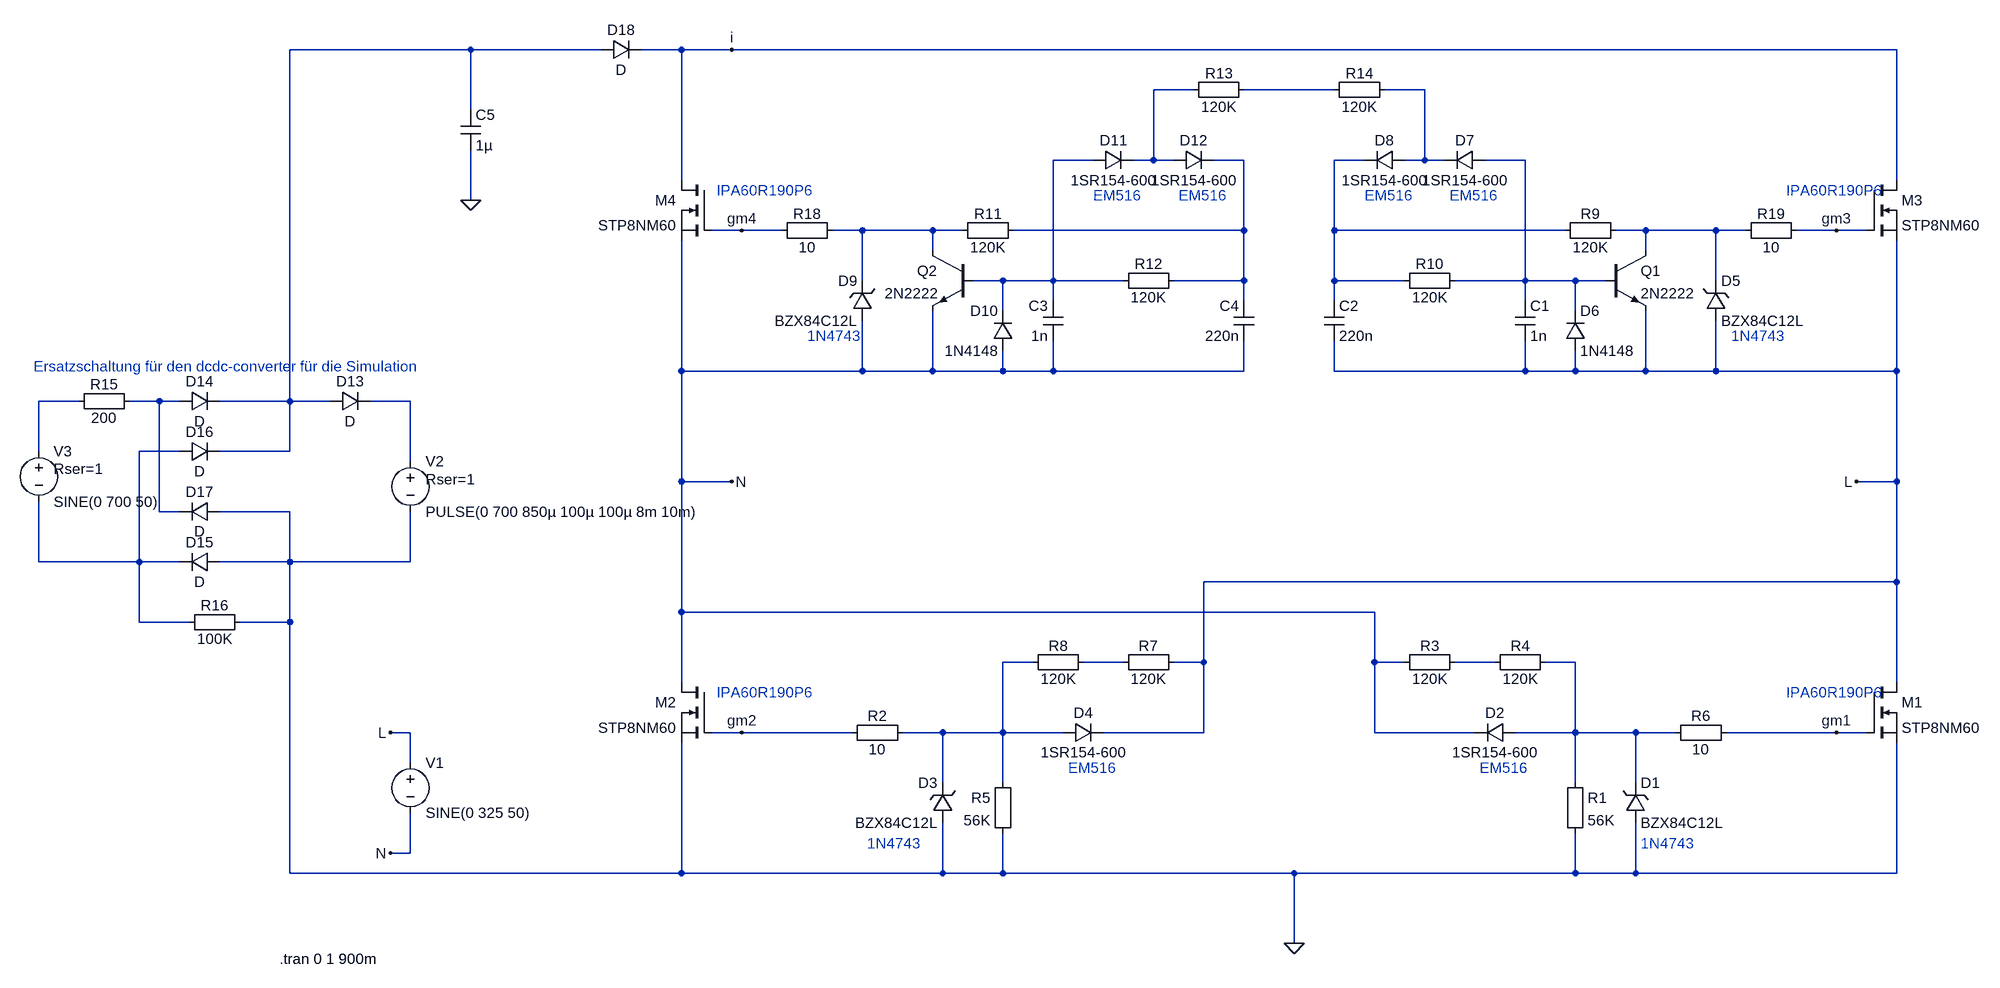
[diagram p0: schematic Einspeisebruecke-MK2-001.asc]
Einspeisebruecke-MK2-001.asc, the LTspice schematic file:
Version 4
SHEET 1 880 680
WIRE -1968 -880 -2256 -880
WIRE -1760 -880 -1968 -880
WIRE -1632 -880 -1696 -880
WIRE -1552 -880 -1632 -880
WIRE 304 -880 -1552 -880
WIRE -816 -816 -880 -816
WIRE -592 -816 -736 -816
WIRE -448 -816 -512 -816
WIRE -1968 -784 -1968 -880
WIRE -976 -704 -1040 -704
WIRE -880 -704 -880 -816
WIRE -880 -704 -912 -704
WIRE -848 -704 -880 -704
WIRE -736 -704 -784 -704
WIRE -544 -704 -592 -704
WIRE -448 -704 -448 -816
WIRE -448 -704 -480 -704
WIRE -416 -704 -448 -704
WIRE -288 -704 -352 -704
WIRE -1632 -672 -1632 -880
WIRE 304 -672 304 -880
WIRE -1968 -640 -1968 -720
WIRE -1536 -592 -1584 -592
WIRE -1472 -592 -1536 -592
WIRE -1344 -592 -1392 -592
WIRE -1232 -592 -1344 -592
WIRE -1184 -592 -1232 -592
WIRE -736 -592 -736 -704
WIRE -736 -592 -1104 -592
WIRE -592 -592 -592 -704
WIRE -224 -592 -592 -592
WIRE -96 -592 -144 -592
WIRE 16 -592 -96 -592
WIRE 64 -592 16 -592
WIRE 208 -592 144 -592
WIRE 256 -592 208 -592
WIRE -1232 -560 -1232 -592
WIRE -96 -560 -96 -592
WIRE -1344 -512 -1344 -592
WIRE -1120 -512 -1168 -512
WIRE -1040 -512 -1040 -704
WIRE -1040 -512 -1120 -512
WIRE -928 -512 -1040 -512
WIRE -736 -512 -736 -592
WIRE -736 -512 -848 -512
WIRE -592 -512 -592 -592
WIRE -480 -512 -592 -512
WIRE -288 -512 -288 -704
WIRE -288 -512 -400 -512
WIRE -208 -512 -288 -512
WIRE -160 -512 -208 -512
WIRE 16 -512 16 -592
WIRE -1040 -480 -1040 -512
WIRE -736 -480 -736 -512
WIRE -592 -480 -592 -512
WIRE -288 -480 -288 -512
WIRE -1120 -464 -1120 -512
WIRE -208 -464 -208 -512
WIRE -1632 -368 -1632 -576
WIRE -1344 -368 -1344 -448
WIRE -1344 -368 -1632 -368
WIRE -1232 -368 -1232 -464
WIRE -1232 -368 -1344 -368
WIRE -1120 -368 -1120 -400
WIRE -1120 -368 -1232 -368
WIRE -1040 -368 -1040 -416
WIRE -1040 -368 -1120 -368
WIRE -736 -368 -736 -416
WIRE -736 -368 -1040 -368
WIRE -592 -368 -592 -416
WIRE -288 -368 -288 -416
WIRE -288 -368 -592 -368
WIRE -208 -368 -208 -400
WIRE -208 -368 -288 -368
WIRE -96 -368 -96 -464
WIRE -96 -368 -208 -368
WIRE 16 -368 16 -448
WIRE 16 -368 -96 -368
WIRE 304 -368 304 -576
WIRE 304 -368 16 -368
WIRE -2592 -320 -2656 -320
WIRE -2464 -320 -2512 -320
WIRE -2432 -320 -2464 -320
WIRE -2256 -320 -2256 -880
WIRE -2256 -320 -2368 -320
WIRE -2192 -320 -2256 -320
WIRE -2064 -320 -2128 -320
WIRE -2656 -240 -2656 -320
WIRE -2432 -240 -2496 -240
WIRE -2256 -240 -2256 -320
WIRE -2256 -240 -2368 -240
WIRE -2064 -224 -2064 -320
WIRE -1632 -192 -1632 -368
WIRE -1552 -192 -1632 -192
WIRE 304 -192 304 -368
WIRE 304 -192 240 -192
WIRE -2464 -144 -2464 -320
WIRE -2432 -144 -2464 -144
WIRE -2256 -144 -2368 -144
WIRE -2656 -64 -2656 -160
WIRE -2496 -64 -2496 -240
WIRE -2496 -64 -2656 -64
WIRE -2432 -64 -2496 -64
WIRE -2256 -64 -2256 -144
WIRE -2256 -64 -2368 -64
WIRE -2064 -64 -2064 -144
WIRE -2064 -64 -2256 -64
WIRE 304 -32 304 -192
WIRE 304 -32 -800 -32
WIRE -1632 16 -1632 -192
WIRE -528 16 -1632 16
WIRE -2496 32 -2496 -64
WIRE -2416 32 -2496 32
WIRE -2256 32 -2256 -64
WIRE -2256 32 -2336 32
WIRE -1072 96 -1120 96
WIRE -928 96 -992 96
WIRE -800 96 -800 -32
WIRE -800 96 -848 96
WIRE -528 96 -528 16
WIRE -480 96 -528 96
WIRE -336 96 -400 96
WIRE -208 96 -256 96
WIRE -1632 128 -1632 16
WIRE 304 128 304 -32
WIRE -2064 208 -2096 208
WIRE -1536 208 -1584 208
WIRE -1360 208 -1536 208
WIRE -1216 208 -1280 208
WIRE -1120 208 -1120 96
WIRE -1120 208 -1216 208
WIRE -1024 208 -1120 208
WIRE -800 208 -800 96
WIRE -800 208 -960 208
WIRE -528 208 -528 96
WIRE -368 208 -528 208
WIRE -208 208 -208 96
WIRE -208 208 -304 208
WIRE -112 208 -208 208
WIRE -48 208 -112 208
WIRE 208 208 32 208
WIRE 256 208 208 208
WIRE -2064 256 -2064 208
WIRE -1216 288 -1216 208
WIRE -1120 288 -1120 208
WIRE -208 288 -208 208
WIRE -112 288 -112 208
WIRE -2064 400 -2064 336
WIRE -2064 400 -2096 400
WIRE -2256 432 -2256 32
WIRE -1632 432 -1632 224
WIRE -1632 432 -2256 432
WIRE -1216 432 -1216 352
WIRE -1216 432 -1632 432
WIRE -1120 432 -1120 368
WIRE -1120 432 -1216 432
WIRE -656 432 -1120 432
WIRE -208 432 -208 368
WIRE -208 432 -656 432
WIRE -112 432 -112 352
WIRE -112 432 -208 432
WIRE 304 432 304 224
WIRE 304 432 -112 432
WIRE -656 544 -656 432
FLAG -656 544 0
FLAG -2096 400 N
FLAG -2096 208 L
FLAG -1552 -192 N
FLAG 240 -192 L
FLAG -1536 -592 gm4
FLAG 208 -592 gm3
FLAG -1536 208 gm2
FLAG 208 208 gm1
FLAG -1552 -880 i
FLAG -1968 -640 0
SYMBOL nmos 256 128 R0
SYMATTR InstName M1
SYMATTR Value STP8NM60
SYMBOL zener -128 352 M180
WINDOW 0 24 64 Left 2
WINDOW 3 24 0 Left 2
SYMATTR InstName D1
SYMATTR Value BZX84C12L
SYMBOL Misc\\EuropeanResistor -224 272 R0
SYMATTR InstName R1
SYMATTR Value 56K
SYMBOL diode -304 192 R90
WINDOW 0 0 32 VBottom 2
WINDOW 3 32 32 VTop 2
SYMATTR InstName D2
SYMATTR Value 1SR154-600
SYMBOL Misc\\EuropeanResistor -384 80 R90
WINDOW 0 5 56 VBottom 2
WINDOW 3 27 56 VTop 2
SYMATTR InstName R3
SYMATTR Value 120K
SYMBOL Misc\\EuropeanResistor -240 80 R90
WINDOW 0 5 56 VBottom 2
WINDOW 3 27 56 VTop 2
SYMATTR InstName R4
SYMATTR Value 120K
SYMBOL nmos -1584 128 M0
SYMATTR InstName M2
SYMATTR Value STP8NM60
SYMBOL zener -1200 352 R180
WINDOW 0 24 64 Left 2
WINDOW 3 24 0 Left 2
SYMATTR InstName D3
SYMATTR Value BZX84C12L
SYMBOL Misc\\EuropeanResistor -1104 272 M0
SYMATTR InstName R5
SYMATTR Value 56K
SYMBOL diode -1024 192 M90
WINDOW 0 0 32 VBottom 2
WINDOW 3 32 32 VTop 2
SYMATTR InstName D4
SYMATTR Value 1SR154-600
SYMBOL Misc\\EuropeanResistor -944 80 M90
WINDOW 0 5 56 VBottom 2
WINDOW 3 27 56 VTop 2
SYMATTR InstName R7
SYMATTR Value 120K
SYMBOL Misc\\EuropeanResistor -1088 80 M90
WINDOW 0 5 56 VBottom 2
WINDOW 3 27 56 VTop 2
SYMATTR InstName R8
SYMATTR Value 120K
SYMBOL nmos 256 -672 R0
SYMATTR InstName M3
SYMATTR Value STP8NM60
SYMBOL zener 0 -448 M180
WINDOW 0 24 64 Left 2
WINDOW 3 24 0 Left 2
SYMATTR InstName D5
SYMATTR Value BZX84C12L
SYMBOL npn -160 -560 R0
SYMATTR InstName Q1
SYMATTR Value 2N2222
SYMBOL diode -224 -400 M180
WINDOW 0 24 64 Left 2
WINDOW 3 24 0 Left 2
SYMATTR InstName D6
SYMATTR Value 1N4148
SYMBOL cap -304 -480 R0
SYMATTR InstName C1
SYMATTR Value 1n
SYMBOL Misc\\EuropeanResistor -128 -608 R90
WINDOW 0 5 56 VBottom 2
WINDOW 3 27 56 VTop 2
SYMATTR InstName R9
SYMATTR Value 120K
SYMBOL Misc\\EuropeanResistor -384 -528 R90
WINDOW 0 5 56 VBottom 2
WINDOW 3 27 56 VTop 2
SYMATTR InstName R10
SYMATTR Value 120K
SYMBOL diode -352 -720 R90
WINDOW 0 0 32 VBottom 2
WINDOW 3 32 32 VTop 2
SYMATTR InstName D7
SYMATTR Value 1SR154-600
SYMBOL diode -480 -720 R90
WINDOW 0 0 32 VBottom 2
WINDOW 3 32 32 VTop 2
SYMATTR InstName D8
SYMATTR Value 1SR154-600
SYMBOL cap -608 -480 R0
SYMATTR InstName C2
SYMATTR Value 220n
SYMBOL nmos -1584 -672 M0
SYMATTR InstName M4
SYMATTR Value STP8NM60
SYMBOL zener -1328 -448 R180
WINDOW 0 24 64 Left 2
WINDOW 3 24 0 Left 2
SYMATTR InstName D9
SYMATTR Value BZX84C12L
SYMBOL npn -1168 -560 M0
SYMATTR InstName Q2
SYMATTR Value 2N2222
SYMBOL diode -1104 -400 R180
WINDOW 0 24 64 Left 2
WINDOW 3 24 0 Left 2
SYMATTR InstName D10
SYMATTR Value 1N4148
SYMBOL cap -1024 -480 M0
SYMATTR InstName C3
SYMATTR Value 1n
SYMBOL Misc\\EuropeanResistor -1200 -608 M90
WINDOW 0 5 56 VBottom 2
WINDOW 3 27 56 VTop 2
SYMATTR InstName R11
SYMATTR Value 120K
SYMBOL Misc\\EuropeanResistor -944 -528 M90
WINDOW 0 5 56 VBottom 2
WINDOW 3 27 56 VTop 2
SYMATTR InstName R12
SYMATTR Value 120K
SYMBOL diode -976 -720 M90
WINDOW 0 0 32 VBottom 2
WINDOW 3 32 32 VTop 2
SYMATTR InstName D11
SYMATTR Value 1SR154-600
SYMBOL diode -848 -720 M90
WINDOW 0 0 32 VBottom 2
WINDOW 3 32 32 VTop 2
SYMATTR InstName D12
SYMATTR Value 1SR154-600
SYMBOL cap -720 -480 M0
SYMATTR InstName C4
SYMATTR Value 220n
SYMBOL Misc\\EuropeanResistor -832 -832 M90
WINDOW 0 5 56 VBottom 2
WINDOW 3 27 56 VTop 2
SYMATTR InstName R13
SYMATTR Value 120K
SYMBOL Misc\\EuropeanResistor -608 -832 M90
WINDOW 0 5 56 VBottom 2
WINDOW 3 27 56 VTop 2
SYMATTR InstName R14
SYMATTR Value 120K
SYMBOL voltage -2064 240 R0
WINDOW 123 0 0 Left 0
WINDOW 39 0 0 Left 0
SYMATTR InstName V1
SYMATTR Value SINE(0 325 50)
SYMBOL voltage -2064 -240 R0
WINDOW 123 0 0 Left 0
WINDOW 39 24 44 Left 2
SYMATTR SpiceLine Rser=1
SYMATTR InstName V2
SYMATTR Value PULSE(0 700 850µ 100µ 100µ 8m 10m)
SYMBOL diode -2192 -304 R270
WINDOW 0 32 32 VTop 2
WINDOW 3 0 32 VBottom 2
SYMATTR InstName D13
SYMBOL diode -2432 -304 R270
WINDOW 0 32 32 VTop 2
WINDOW 3 0 32 VBottom 2
SYMATTR InstName D14
SYMBOL diode -2368 -80 R90
WINDOW 0 0 32 VBottom 2
WINDOW 3 32 32 VTop 2
SYMATTR InstName D15
SYMBOL diode -2432 -224 R270
WINDOW 0 32 32 VTop 2
WINDOW 3 0 32 VBottom 2
SYMATTR InstName D16
SYMBOL diode -2368 -160 R90
WINDOW 0 0 32 VBottom 2
WINDOW 3 32 32 VTop 2
SYMATTR InstName D17
SYMBOL Misc\\EuropeanResistor -2432 16 M90
WINDOW 0 5 56 VBottom 2
WINDOW 3 27 56 VTop 2
SYMATTR InstName R16
SYMATTR Value 100K
SYMBOL diode -1760 -864 R270
WINDOW 0 32 32 VTop 2
WINDOW 3 0 32 VBottom 2
SYMATTR InstName D18
SYMBOL cap -1984 -784 R0
SYMATTR InstName C5
SYMATTR Value 1µ
SYMBOL Misc\\EuropeanResistor -1488 -608 M90
WINDOW 0 5 56 VBottom 2
WINDOW 3 27 56 VTop 2
SYMATTR InstName R18
SYMATTR Value 10
SYMBOL Misc\\EuropeanResistor 48 -608 M90
WINDOW 0 5 56 VBottom 2
WINDOW 3 27 56 VTop 2
SYMATTR InstName R19
SYMATTR Value 10
SYMBOL Misc\\EuropeanResistor -1376 192 M90
WINDOW 0 5 56 VBottom 2
WINDOW 3 27 56 VTop 2
SYMATTR InstName R2
SYMATTR Value 10
SYMBOL Misc\\EuropeanResistor -64 192 M90
WINDOW 0 5 56 VBottom 2
WINDOW 3 27 56 VTop 2
SYMATTR InstName R6
SYMATTR Value 10
SYMBOL voltage -2656 -256 R0
WINDOW 123 0 0 Left 0
WINDOW 39 24 44 Left 2
SYMATTR SpiceLine Rser=1
SYMATTR InstName V3
SYMATTR Value SINE(0 700 50)
SYMBOL Misc\\EuropeanResistor -2608 -336 M90
WINDOW 0 5 56 VBottom 2
WINDOW 3 27 56 VTop 2
SYMATTR InstName R15
SYMATTR Value 200
TEXT -2272 568 Left 2 !.tran 0 1 900m
TEXT -1576 -656 Left 2 ;IPA60R190P6
TEXT -1576 144 Left 2 ;IPA60R190P6
TEXT 128 144 Left 2 ;IPA60R190P6
TEXT 128 -656 Left 2 ;IPA60R190P6
TEXT -1432 -424 Left 2 ;1N4743
TEXT 40 -424 Left 2 ;1N4743
TEXT -104 384 Left 2 ;1N4743
TEXT -1336 384 Left 2 ;1N4743
TEXT -976 -648 Left 2 ;EM516
TEXT -840 -648 Left 2 ;EM516
TEXT -544 -648 Left 2 ;EM516
TEXT -408 -648 Left 2 ;EM516
TEXT -360 264 Left 2 ;EM516
TEXT -1016 264 Left 2 ;EM516
TEXT -2664 -376 Left 2 ;Ersatzschaltung für den dcdc-converter für die Simulation

The netlist it stands for:
* Einspeisebruecke-MK2-001.asc
M1 L gm1 0 0 STP8NM60
D1 0 N018 BZX84C12L
R1 N018 0 56K
D2 N018 N 1SR154-600
R3 N017 N 120K
R4 N018 N017 120K
M2 N gm2 0 0 STP8NM60
D3 0 N015 BZX84C12L
R5 N015 0 56K
D4 N015 L 1SR154-600
R7 N016 L 120K
R8 N015 N016 120K
M3 i gm3 L L STP8NM60
D5 L N010 BZX84C12L
Q1 N010 N008 L 0 2N2222
D6 L N008 1N4148
C1 N008 L 1n
R9 N010 N007 120K
R10 N008 N007 120K
D7 N008 N004 1SR154-600
D8 N004 N007 1SR154-600
C2 N007 L 220n
M4 i gm4 N N STP8NM60
D9 N N009 BZX84C12L
Q2 N009 N005 N 0 2N2222
D10 N N005 1N4148
C3 N005 N 1n
R11 N009 N006 120K
R12 N005 N006 120K
D11 N005 N002 1SR154-600
D12 N002 N006 1SR154-600
C4 N006 N 220n
R13 N002 N003 120K
R14 N003 N004 120K
V1 L N SINE(0 325 50)
V2 N013 0 PULSE(0 700 850µ 100µ 100µ 8m 10m) Rser=1
D13 N001 N013 D
D14 N012 N001 D
D15 0 N014 D
D16 N014 N001 D
D17 0 N012 D
R16 N014 0 100K
D18 N001 i D
C5 N001 0 1µ
R18 gm4 N009 10
R19 N010 gm3 10
R2 gm2 N015 10
R6 N018 gm1 10
V3 N011 N014 SINE(0 700 50) Rser=1
R15 N011 N012 200
.model D D
.lib standard.dio
.model NPN NPN
.model PNP PNP
.lib standard.bjt
.model NMOS NMOS
.model PMOS PMOS
.lib standard.mos
.tran 0 1 900m
* IPA60R190P6
* IPA60R190P6
* IPA60R190P6
* IPA60R190P6
* 1N4743
* 1N4743
* 1N4743
* 1N4743
* EM516
* EM516
* EM516
* EM516
* EM516
* EM516
* Ersatzschaltung für den dcdc-converter für die Simulation
.backanno
.end